# Altium schematic sheet PMIC.SchDoc: RK3399 SOM Module
size A3; Date: 23.05.2023; Author: Łukasz Nowarkiewicz; SheetNumber: 17; SheetTotal: 21; RegistrationBookNumber: 144201; title_sheet: Power Management IC
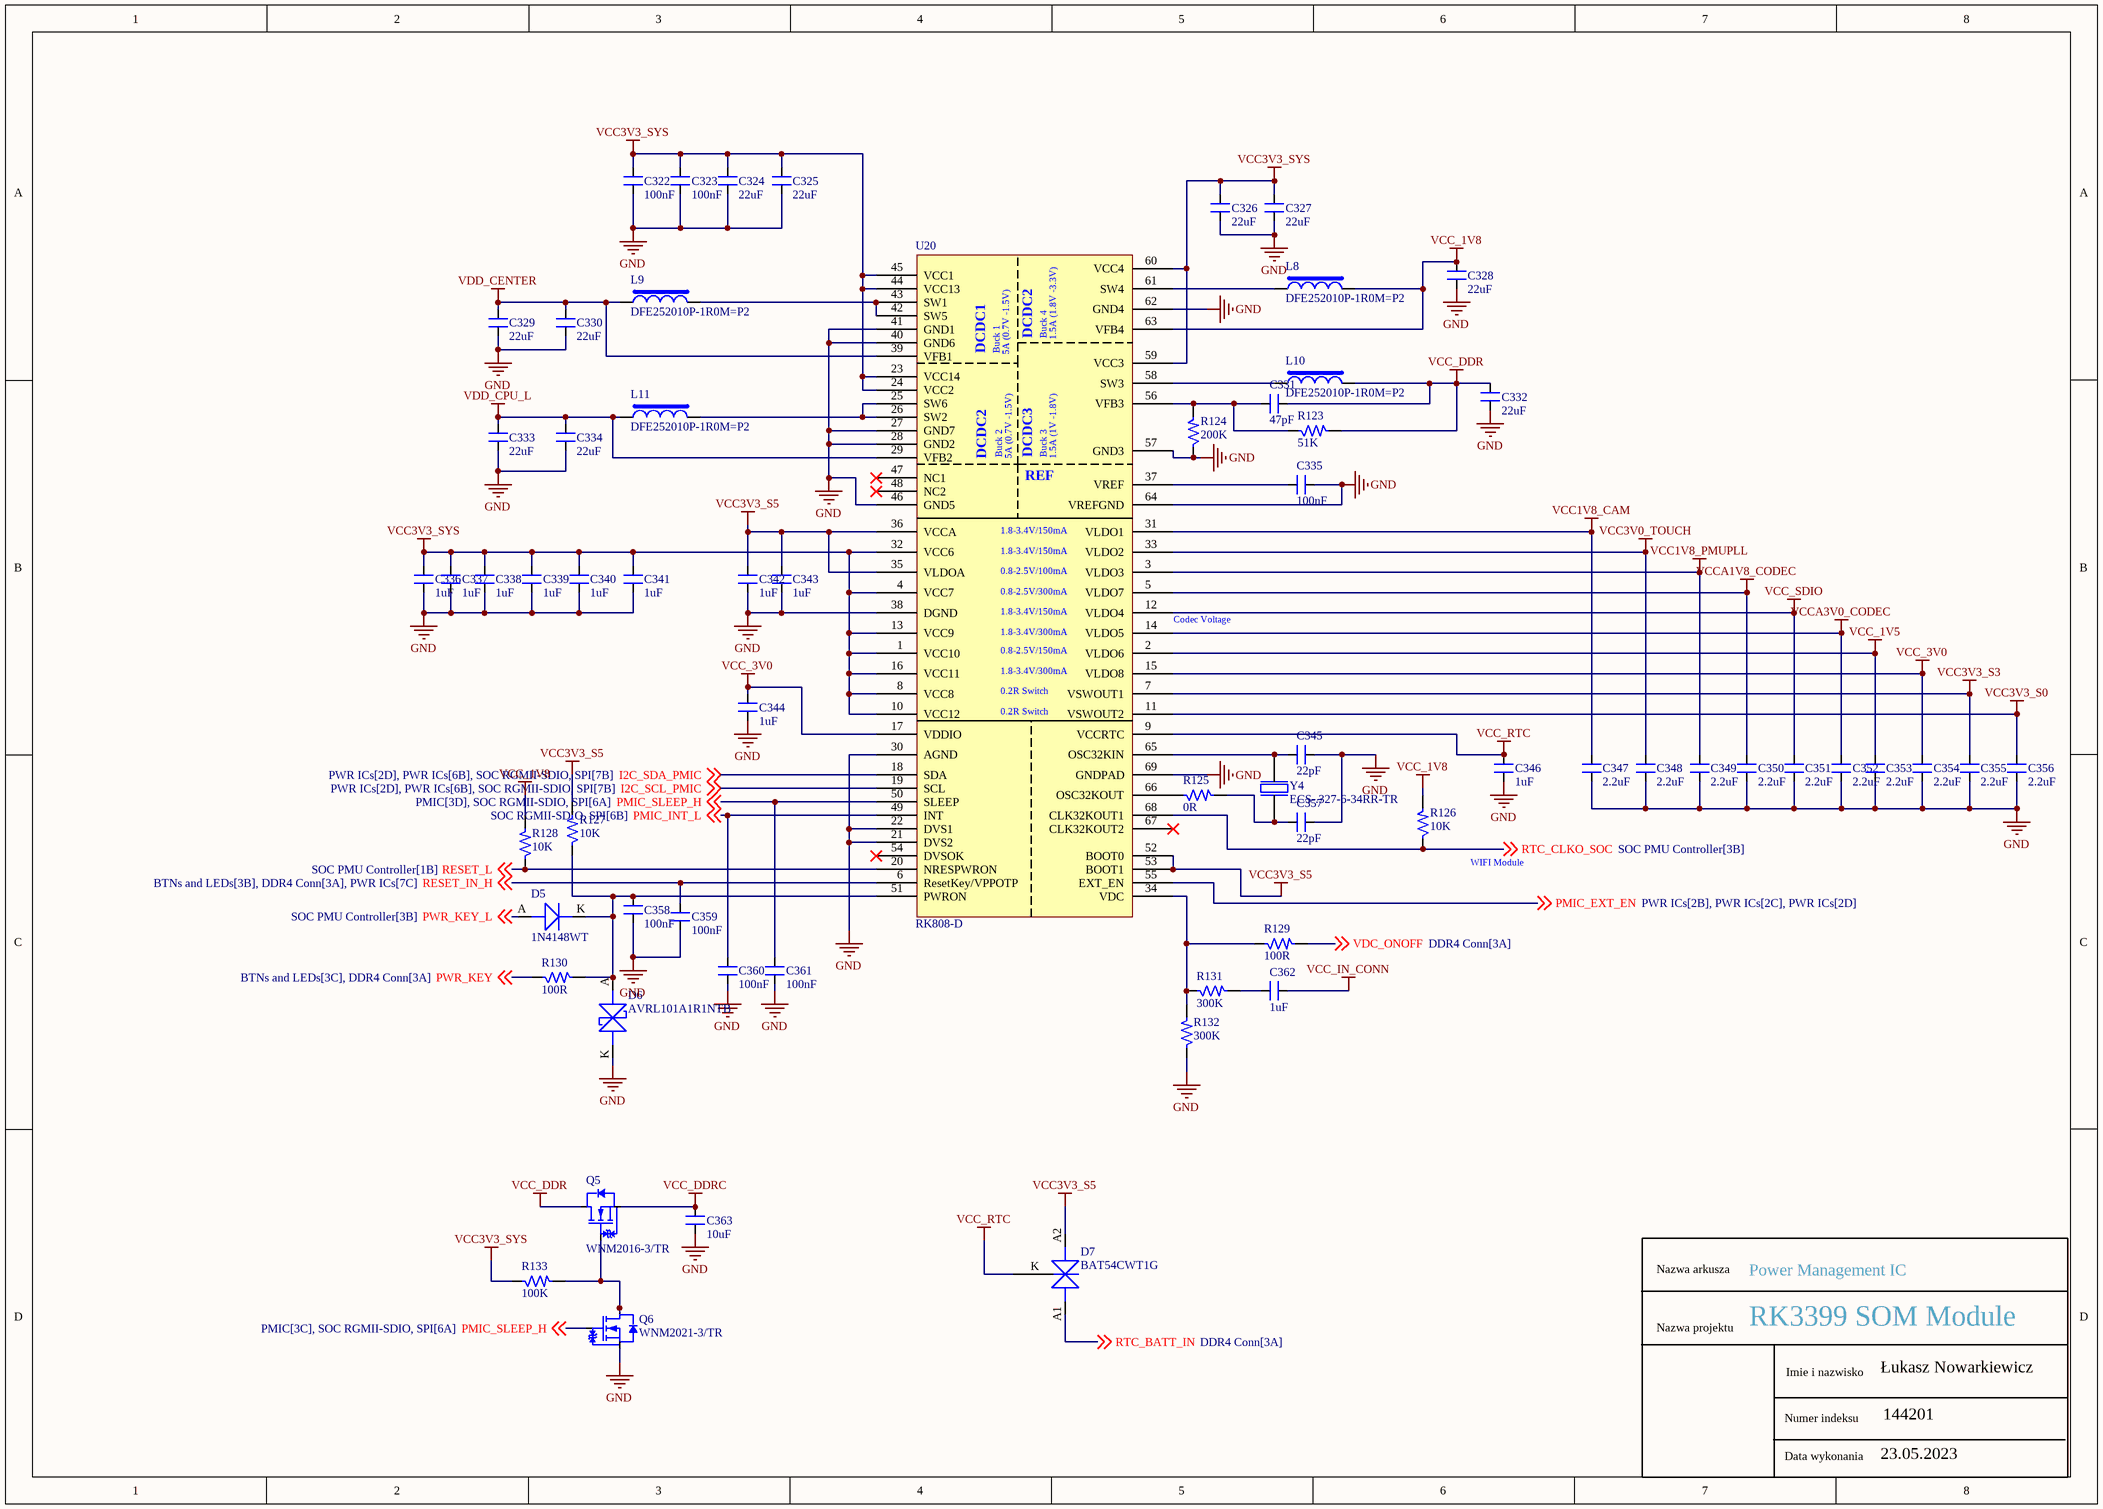
[diagram p0: PMIC.SchDoc]

## Parts
C322  100nF  [CAP_0402]
C323  100nF  [CAP_0402]
C324  22uF  [CAP_0603]
C325  22uF  [CAP_0603]
C326  22uF  [CAP_0603]
C327  22uF  [CAP_0603]
C328  22uF  [CAP_0603]
C329  22uF  [CAP_0603]
C330  22uF  [CAP_0603]
C331  47pF  [CAP_0402]
C332  22uF  [CAP_0603]
C333  22uF  [CAP_0603]
C334  22uF  [CAP_0603]
C335  100nF  [CAP_0402]
C336  1uF  [CAP_0402]
C337  1uF  [CAP_0402]
C338  1uF  [CAP_0402]
C339  1uF  [CAP_0402]
C340  1uF  [CAP_0402]
C341  1uF  [CAP_0402]
C342  1uF  [CAP_0402]
C343  1uF  [CAP_0402]
C344  1uF  [CAP_0402]
C345  22pF  [CAP_0402]
C346  1uF  [CAP_0402]
C347  2.2uF  [CAP_0402]
C348  2.2uF  [CAP_0402]
C349  2.2uF  [CAP_0402]
C350  2.2uF  [CAP_0402]
C351  2.2uF  [CAP_0402]
C352  2.2uF  [CAP_0402]
C353  2.2uF  [CAP_0402]
C354  2.2uF  [CAP_0402]
C355  2.2uF  [CAP_0402]
C356  2.2uF  [CAP_0402]
C357  22pF  [CAP_0402]
C358  100nF  [CAP_0402]
C359  100nF  [CAP_0402]
C360  100nF  [CAP_0402]
C361  100nF  [CAP_0402]
C362  1uF  [CAP_0402]
C363  10uF  [CAP_0402]
D5  1N4148WT  [DIO_SOD523]
D6  AVRL101A1R1NTB  [DIO_0402_SMD]
D7  BAT54CWT1G  [DIO_SOT-323-3]
L8  DFE252010P-1R0M=P2  [IND_1008]
L9  DFE252010P-1R0M=P2  [IND_1008]
L10  DFE252010P-1R0M=P2  [IND_1008]
L11  DFE252010P-1R0M=P2  [IND_1008]
Q5  WNM2016-3/TR  [SOT 23-3]
Q6  WNM2021-3/TR  [SOT-323-3]
R123  51K  [RES_0402]
R124  200K  [RES_0402]
R125  0R  [RES_0402]
R126  10K  [RES_0402]
R127  10K  [RES_0402]
R128  10K  [RES_0402]
R129  100R  [RES_0402]
R130  100R  [RES_0402]
R131  300K  [RES_0402]
R132  300K  [RES_0402]
R133  100K  [RES_0402]
U20  RK808-D  [QFN68_13.7_220.4X220.4_SMD]
Y4  ECS-.327-6-34RR-TR  [XTAL_ECS-.327-6-34RR-TR]

## Nets
GND: C322.1 C323.1 C324.1 C325.1 C326.1 C327.1 C328.1 C329.1 C330.1 C332.1 C333.1 C334.1 C335.1 C336.2 C337.1 C338.1 C339.1 C340.1 C341.1 C342.1 C343.1 C344.1 C345.2 C346.1 C347.1 C348.1 C349.1 C350.1 C351.1 C352.1 C353.1 C354.1 C355.1 C356.1 C357.2 C358.1 C359.1 C360.1 C361.1 C363.1 D6.K Q6.2(S) R124.1 R132.1 U20.21(DVS2) U20.22(DVS1) U20.27(GND7) U20.28(GND2) U20.30(AGND) U20.38(DGND) U20.40(GND6) U20.41(GND1) U20.46(GND5) U20.57(GND3) U20.62(GND4) U20.64(VREFGND) U20.69(GNDPAD)
VCC1V8_CAM: C347.2 U20.31(VLDO1)
VCC1V8_PMUPLL: C349.2 U20.3(VLDO3)
VCC3V0_TOUCH: C348.2 U20.33(VLDO2)
VCC3V3_S0: C356.2 U20.11(VSWOUT2)
VCC3V3_S3: C355.2 U20.7(VSWOUT1)
VCC3V3_S5: C342.2 C343.2 D7.A2 R127.2 U20.35(VLDOA) U20.36(VCCA) U20.52(BOOT0) U20.53(BOOT1)
VCC3V3_SYS: C322.2 C323.2 C324.2 C325.2 C326.2 C327.2 C336.1 C337.2 C338.2 C339.2 C340.2 C341.2 R133.1 U20.1(VCC10) U20.4(VCC7) U20.8(VCC8) U20.10(VCC12) U20.13(VCC9) U20.16(VCC11) U20.23(VCC14) U20.24(VCC2) U20.32(VCC6) U20.44(VCC13) U20.45(VCC1) U20.59(VCC3) U20.60(VCC4)
VCC_1V5: C353.2 U20.2(VLDO6)
VCC_1V8: C328.2 L8.2 R126.2 R128.2 U20.63(VFB4)
VCC_3V0: C344.2 C354.2 U20.15(VLDO8) U20.17(VDDIO)
VCC_DDR: C331.2 C332.2 L10.2 Q5.3(D) R123.2
VCC_DDRC: C363.2 Q5.2(S)
VCC_IN_CONN: C362.1
VCC_RTC: C346.2 D7.K U20.9(VCCRTC)
VCC_SDIO: C351.2 U20.12(VLDO4)
VCCA1V8_CODEC: C350.2 U20.5(VLDO7)
VCCA3V0_CODEC: C352.2 U20.14(VLDO5)
VDD_CENTER: C329.2 C330.2 L9.1 U20.39(VFB1)
VDD_CPU_L: C333.2 C334.2 L11.1 U20.29(VFB2)
I2C_SCL_PMIC: U20.19(SCL) ; off-sheet I2C_SCL_PMIC
I2C_SDA_PMIC: U20.18(SDA) ; off-sheet I2C_SDA_PMIC
PMIC_EXT_EN: U20.55(EXT_EN) ; off-sheet PMIC_EXT_EN
PMIC_INT_L: C360.2 U20.49(INT) ; off-sheet PMIC_INT_L
PMIC_SLEEP_H: C361.2 Q6.1(G) U20.50(SLEEP) ; off-sheet PMIC_SLEEP_H
PWR_KEY: R130.1 ; off-sheet PWR_KEY
PWR_KEY_L: D5.A(ANODE) ; off-sheet PWR_KEY_L
RESET_IN_H: C359.2 U20.6(ResetKey/VPPOTP) ; off-sheet RESET_IN_H
RESET_L: R128.1 U20.20(NRESPWRON) ; off-sheet RESET_L
RTC_BATT_IN: D7.A1 ; off-sheet RTC_BATT_IN
RTC_CLKO_SOC: R126.1 U20.68(CLK32KOUT1) ; off-sheet RTC_CLKO_SOC
VDC_ONOFF: R129.2 ; off-sheet VDC_ONOFF
NetC331_1: C331.1 R123.1 R124.2 U20.56(VFB3)
NetC335_2: C335.2 U20.37(VREF)
NetC345_1: C345.1 U20.65(OSC32KIN) Y4.2
NetC357_1: C357.1 R125.2 Y4.1
NetC358_2: C358.2 D5.K(CATHODE) D6.A R127.1 R130.2 U20.51(PWRON)
NetC362_2: C362.2 R131.2
NetL8_1: L8.1 U20.61(SW4)
NetL9_2: L9.2 U20.42(SW5) U20.43(SW1)
NetL10_1: L10.1 U20.58(SW3)
NetL11_2: L11.2 U20.25(SW6) U20.26(SW2)
NetQ5_1: Q5.1(G) Q6.3(D) R133.2
NetR125_1: R125.1 U20.66(OSC32KOUT)
NetR129_1: R129.1 R131.1 R132.2 U20.34(VDC)

Not connected (* = marked no-connect by the designer): U20 47(NC1)* 48(NC2)* 54(DVSOK)* 67(CLK32KOUT2)*

## Notes on the sheet
- (near U20) Codec Voltage
- (near R126) WIFI Module
- Nazwa arkusza
- Nazwa projektu
- Imie i nazwisko
- Data wykonania
- Numer indeksu
- (in symbol IC_RK808-D-QFN68) DCDC2; Buck 4; 1.5A (1.8V -3.3V); DCDC1; Buck 1; 5A (0.7V -1.5V); Buck 2; DCDC3; Buck 3; 1.5A (1V -1.8V); REF; 1.8-3.4V/150mA; 0.8-2.5V/100mA; 0.8-2.5V/300mA; 1.8-3.4V/300mA; 0.8-2.5V/150mA; 0.2R Switch

## Library data of the parts
C322 C323 C335 C358-C361 = CAP_100nF-25V-10%-0402: 0.1µF ±10% 25V Ceramic Capacitor X7R 0402 (1005 Metric); Manufacturer: Walsin Technology Corporation; Manufacturer Part Number: 0402B104K250CT; Case/Package: 0402; Supplier-1: Digikey
C324-C330 C332-C334 = CAP_22uF-10V-20%-0603: 22µF ±20% 10V Ceramic Capacitor X5R 0603 (1608 Metric); Manufacturer: Murata Electronics; Manufacturer Part Number: GRM188R61A226ME15D; Case/Package: 0603; Supplier-1: Digikey
C331 = CAP_47pF-10V-10%-0402: 47pF ±10% 10V Ceramic Capacitor C0G, NP0 0402 (1005 Metric); Manufacturer: KEMET; Manufacturer Part Number: C0402C470K8GAC7867; Case/Package: 0402; Supplier-1: Supplier-1
C336-C344 C346 C362 = CAP_1uF-16V-10%-0402: 1µF ±10% 16V Ceramic Capacitor X5R 0402 (1005 Metric); Manufacturer: Knowles Novacap; Manufacturer Part Number: 0402BW105K160YT; Case/Package: 0402; Supplier-1: Digikey
C345 C357 = CAP_22pF-10V-10%-0402: 22pF ±10% 10V Ceramic Capacitor C0G, NP0 0402 (1005 Metric); Manufacturer: KEMET; Manufacturer Part Number: C0402C220K8GACTU; Case/Package: 0402; Supplier-1: Digikey
C347-C356 = CAP_2.2uF-10V-10%-0402: 2.2µF ±10% 10V Ceramic Capacitor X5R 0402 (1005 Metric); Manufacturer: Murata Electronics; Manufacturer Part Number: GRM155R61A225KE95D; Case/Package: 0402; Supplier-1: Digikey
C363 = CAP_10uF-10V-20%-0402: 10µF ±20% 10V Ceramic Capacitor X5R 0402 (1005 Metric); Manufacturer Part Number: CL05A106MP5NUNC; Manufacturer: Samsung Electro-Mechanics; Case/Package: 0402; Supplier-1: Digikey
D5 = DIO_75V-200mA-SOD-523F: Diode Standard 100V 300mA (DC) Surface Mount SOD-123; Manufacturer: FAIRCHILD; Manufacturer Part Number: 1N4148WT; Case/Package: SOD123; Supplier-1: SIRICOM
D6 = DIO-T_10V-39V-0402: 39V Varistor 1 Circuit Surface Mount, MLCV 0402 (1005 Metric); Manufacturer: TDK Corporation; Manufacturer Part Number: AVRL101A1R1NTB; Supplier-1: Digikey; Case/Package: 0402
D7 = DIO-S-A_30V-200mA-SOT-323: Diode Array 1 Pair Common Cathode Schottky 30V 200mA (DC) Surface Mount SC-70, SOT-323; Manufacturer: ON Semiconductor; Manufacturer Part Number: BAT54CWT1G; Case/Package: SOT323; Supplier-1: Digikey
L8-L11 = IND_1uH-3.8A-20%-1008: 1µH Shielded Wirewound Inductor 3.8A 54mOhm Max 1008 (2520 Metric); Manufacturer: Murata Electronics; Manufacturer Part Number: DFE252010P-1R0M=P2; Case/Package: 1008; Supplier-1: Digikey
Q5 = MOSFET-N_20V-2.9A-SOT-23: N Channel 20V 2.9A 1V @ 250uA 47mΩ @ 3.6A,4.5V 700mW SOT-23(SOT-23-3) MOSFET RoHS; Manufacturer: WILLSEMI(Will Semicon); Manufacturer Part Number: WNM2016-3/TR; Case/Package: SOT-23(SOT-23-3); Supplier-1: LCSC
Q6 = MOSFET-N_20V-820mA-SOT-323: N Channel 20V 820mA 850mV @ 250uA 310mΩ @ 550mA,4.5V 310mW SOT-323(SC-70) MOSFET RoHS; Manufacturer: WILLSEMI(Will Semicon); Manufacturer Part Number: WNM2021-3/TR; Case/Package: SOT-323(SC-70); Supplier-1: LCSC
R123 = RES_51K-0.1W-1%-0402: 51 kOhms ±1% 0.1W, 1/10W Chip Resistor 0402 (1005 Metric) Automotive AEC-Q200 Thick Film; Manufacturer: Panasonic Electronic Components; Manufacturer Part Number: ERJ-2RKF5102X; Case/Package: 0402; Supplier-1: Digikey
R124 = RES_200K-0.1W-1%-0402: 200 kOhms ±1% 0.1W, 1/10W Chip Resistor 0402 (1005 Metric) Automotive AEC-Q200 Thick Film; Manufacturer: Panasonic Electronic Components; Manufacturer Part number: ERJ-2RKF2003X; Case/Package: 0402; Supplier-1: Digikey
R125 = RES_0R-0.1W-1%-0402: 0 Ohms Jumper 0.1W, 1/10W Chip Resistor 0402 (1005 Metric) Automotive AEC-Q200 Thick Film; Manufacturer: Panasonic Electronic Components; Manufacturer Part Number: ERJ-2GE0R00X; Case/Package: 0402; Supplier-1: Digikey
R126-R128 = RES_10K-0.1W-1%-0402: 10 kOhms ±1% 0.1W, 1/10W Chip Resistor 0402 (1005 Metric) Anti-Sulfur Thin Film; Manufacturer: Vishay Beyschlag/Draloric/BC Components; Manufacturer Part Number: MCS04020C1002FE000; Case/Package: 0402; Supplier-1: Digikey
R129 R130 = RES_100R-0.1W-1%-0402: 100 Ohms ±1% 0.1W, 1/10W Chip Resistor 0402 (1005 Metric) Automotive AEC-Q200, Moisture Resistant Thick Film; Manufacturer: KOA Speer Electronics, Inc.; Manufacturer Part Number: RK73H1ETTP1000F; Case/Package: 0402; Supplier-1: Digikey
R131 R132 = RES_300K-0.1W-1%-0402: 300 kOhms ±1% 0.1W, 1/10W Chip Resistor 0402 (1005 Metric) Automotive AEC-Q200 Thick Film; Manufacturer: Panasonic Electronic Components; Manufacturer Part Number: ERJ-2RKF3003X; Case/Package: 0402; Supplier-1: Digikey
R133 = RES_100K-0.1W-1%-0402: 100 kOhms ±1% 0.1W, 1/10W Chip Resistor 0402 (1005 Metric) Anti-Sulfur Thin Film; Manufacturer: Vishay Beyschlag/Draloric/BC Components; Manufacturer Part Number: MCS04020C1003FE000; Case/Package: 0402; Supplier-1: Digikey
U20 = IC_RK808-D-QFN68: The RK808 is a complete power supply solution for Portable systems.; Manufacturer: Rockchip; Manufacturer Part Number: RK808-D; Case/Package: QFN68; Supplier-1: Rockchip
Y4 = XTAL_32.768Khz-22pF-SMD: 32.768kHz ±20ppm Crystal 12pF 80 kOhms 2-SMD, No Lead; Manufacturer: Ecliptek; Manufacturer Part Number: ECS-.327-6-34RR-TR; Case/Package: 0603; Supplier-1: Digikey